# Altium schematic sheet Module-POWER.SchDoc
size A3; SheetNumber: 1; SheetTotal: 1
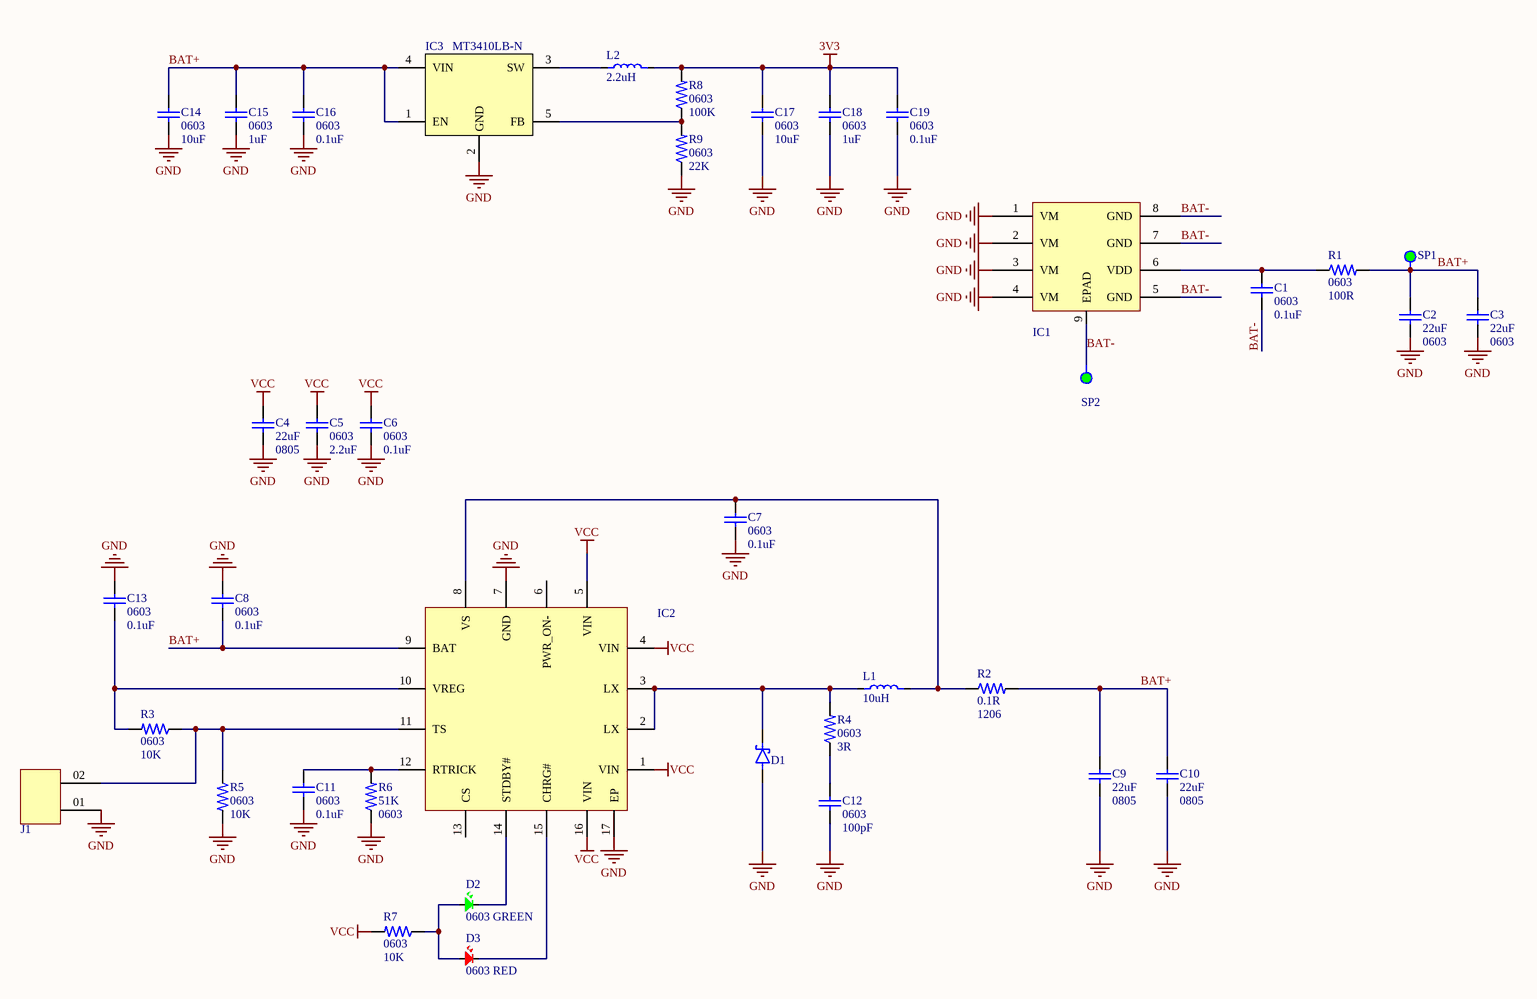
[diagram p0: Module-POWER.SchDoc]

## Parts
C1  value 0.1uF  Package: 0603  [SMD-CAP-0603-YAGEO]  (hidden comment: 0.1 µF ±10% 16V Ceramic Capacitor X7R 0603 (1608 Metric))
C2  value 22uF  Package: 0603  [SMD-CAP-0603-YAGEO]  (hidden comment: 22 µF ±20% 10V Ceramic Capacitor X5R 0603 (1608 Metric))
C3  value 22uF  Package: 0603  [SMD-CAP-0603-YAGEO]  (hidden comment: 22 µF ±20% 10V Ceramic Capacitor X5R 0603 (1608 Metric))
C4  value 22uF  Package: 0805  [SMD-CAP-0805-YAGEO]  (hidden comment: 22 µF ±20% 25V Ceramic Capacitor X5R 0805 (2012 Metric))
C5  value 2.2uF  Package: 0603  [SMD-CAP-0603-YAGEO]  (hidden comment: 2.2 µF ±10% 25V Ceramic Capacitor X5R 0603 (1608 Metric))
C6  value 0.1uF  Package: 0603  [SMD-CAP-0603-YAGEO]  (hidden comment: 0.1 µF ±10% 100V Ceramic Capacitor X7R 0603 (1608 Metric))
C7  value 0.1uF  Package: 0603  [SMD-CAP-0603-YAGEO]  (hidden comment: 0.1 µF ±10% 100V Ceramic Capacitor X7R 0603 (1608 Metric))
C8  value 0.1uF  Package: 0603  [SMD-CAP-0603-YAGEO]  (hidden comment: 0.1 µF ±10% 100V Ceramic Capacitor X7R 0603 (1608 Metric))
C9  value 22uF  Package: 0805  [SMD-CAP-0805-YAGEO]  (hidden comment: 22 µF ±20% 25V Ceramic Capacitor X5R 0805 (2012 Metric))
C10  value 22uF  Package: 0805  [SMD-CAP-0805-YAGEO]  (hidden comment: 22 µF ±20% 25V Ceramic Capacitor X5R 0805 (2012 Metric))
C11  value 0.1uF  Package: 0603  [SMD-CAP-0603-YAGEO]  (hidden comment: 0.1 µF ±10% 100V Ceramic Capacitor X7R 0603 (1608 Metric))
C12  value 100pF  Package: 0603  [SMD-CAP-0603-YAGEO]  (hidden comment: 100 pF ±5% 50V Ceramic Capacitor C0G, NP0 0603 (1608 Metric))
C13  value 0.1uF  Package: 0603  [SMD-CAP-0603-YAGEO]  (hidden comment: 0.1 µF ±10% 100V Ceramic Capacitor X7R 0603 (1608 Metric))
C14  value 10uF  Package: 0603  [SMD-CAP-0603-YAGEO]  (hidden comment: 10 µF ±20% 25V Ceramic Capacitor X5R 0603 (1608 Metric))
C15  value 1uF  Package: 0603  [SMD-CAP-0603-YAGEO]  (hidden comment: 1 µF -20%, +80% 10V Ceramic Capacitor Y5V (F) 0603 (1608 Metric))
C16  value 0.1uF  Package: 0603  [SMD-CAP-0603-YAGEO]  (hidden comment: 0.1 µF ±10% 16V Ceramic Capacitor X7R 0603 (1608 Metric))
C17  value 10uF  Package: 0603  [SMD-CAP-0603-YAGEO]  (hidden comment: 10 µF ±20% 25V Ceramic Capacitor X5R 0603 (1608 Metric))
C18  value 1uF  Package: 0603  [SMD-CAP-0603-YAGEO]  (hidden comment: 1 µF -20%, +80% 10V Ceramic Capacitor Y5V (F) 0603 (1608 Metric))
C19  value 0.1uF  Package: 0603  [SMD-CAP-0603-YAGEO]  (hidden comment: 0.1 µF ±10% 16V Ceramic Capacitor X7R 0603 (1608 Metric))
D1  Diode 40 V 3A Surface Mount DO-214AC (SMA)  [SMD-DO-214AC-214-CT]  (value not drawn)
D2  0603 GREEN  [LED0603_GREEN]
D3  0603 RED  [LED0603_RED]
IC1  XB8089D  [SOIC-8-XB8089D]  (value not drawn)
IC2  5V~12V Lithium-ion/Polymer 1~2 2A TQFN-16-EP(4x4) Battery Management ROHS  [TQFN-16 - TP5100]  (value not drawn)
IC3  MT3410LB-N  [SOT23-5-MT3410]
J1  Connector Header Through Hole 2 position  [HEADER-2.54-2]  (value not drawn)
L1  value 10uH  [SMD-HxLxW-4.5x6.5x6.0-PEC]  (hidden comment: 10 µH Shielded Drum Core, Wirewound Inductor 3.7 A 74.8mOhm Max 2-SMD, J-Lead)
L2  value 2.2uH  [SMD-HxLxW-3.0x5.5x5.0-PEC]  (hidden comment: 2.2 µH Shielded Drum Core, Wirewound Inductor 6.3 A 22mOhm Max 2-SMD, J-Lead)
R1  value 100R  Package: 0603  [SMD-RES-0603-RS]  (hidden comment: 100 Ohms ±1% 0.1W, 1/10W Chip Resistor 0603 (1608 Metric) Automotive AEC-Q200, High Voltage Thick Film)
R2  value 0.1R  Package: 1206  [SMD-RES-1206-YAGEO]  (hidden comment: 100 mOhms ±5% 0.25W, 1/4W Chip Resistor 1206 (3216 Metric) Current Sense Thick Film)
R3  value 10K  Package: 0603  [SMD-RES-0603-YAGEO]  (hidden comment: 10 kOhms ±1% 0.1W, 1/10W Chip Resistor 0603 (1608 Metric) Moisture Resistant Thick Film)
R4  value 3R  Package: 0603  [SMD-RES-0603-YAGEO]  (hidden comment: 3 Ohms ±1% 0.1W, 1/10W Chip Resistor 0603 (1608 Metric) Thin Film)
R5  value 10K  Package: 0603  [SMD-RES-0603-YAGEO]  (hidden comment: 10 kOhms ±1% 0.1W, 1/10W Chip Resistor 0603 (1608 Metric) Moisture Resistant Thick Film)
R6  value 51K  Package: 0603  [SMD-RES-0603-YAGEO]  (hidden comment: 51 kOhms ±1% 0.1W, 1/10W Chip Resistor 0603 (1608 Metric) Moisture Resistant Thick Film)
R7  value 10K  Package: 0603  [SMD-RES-0603-YAGEO]  (hidden comment: 10 kOhms ±1% 0.1W, 1/10W Chip Resistor 0603 (1608 Metric) Moisture Resistant Thick Film)
R8  value 100K  Package: 0603  [SMD-RES-0603-YAGEO]  (hidden comment: 100 kOhms ±1% 0.1W, 1/10W Chip Resistor 0603 (1608 Metric) Moisture Resistant Thick Film)
R9  value 22K  Package: 0603  [SMD-RES-0603-YAGEO]  (hidden comment: 22 kOhms ±1% 0.1W, 1/10W Chip Resistor 0603 (1608 Metric) Moisture Resistant Thick Film)
SP1  SP  [SOLDERING PAD BIG 3]  (value not drawn)  (no BOM)
SP2  SP  [SOLDERING PAD BIG 3]  (value not drawn)  (no BOM)

## Nets
3V3: C17.2 C18.2 C19.2 L2.2 R8.2
GND: C2.2 C3.1 C4.1 C5.1 C6.1 C7.1 C8.1 C9.1 C10.1 C11.1 C12.1 C13.1 C14.1 C15.1 C16.1 C17.1 C18.1 C19.1 D1.2(A) IC1.1(VM) IC1.2(VM) IC1.3(VM) IC1.4(VM) IC2.7(GND) IC2.17(EP) IC3.2(GND) J1.01 R5.2 R6.1 R9.1
VCC: C4.2 C5.2 C6.2 IC2.1(VIN) IC2.4(VIN) IC2.5(VIN) IC2.16(VIN) R7.2
BAT+: C2.1 C3.2 C8.2 C9.2 C10.2 C14.2 C15.2 C16.2 IC2.9(BAT) IC3.1(EN) IC3.4(VIN) R1.2 R2.2 SP1.1
BAT-: C1.1 IC1.5(GND) IC1.7(GND) IC1.8(GND) IC1.9(EPAD) SP2.1
NetC1_2: C1.2 IC1.6(VDD) R1.1
NetC7_2: C7.2 IC2.8(VS) L1.2 R2.1
NetC11_2: C11.2 IC2.12(RTRICK) R6.2
NetC12_2: C12.2 R4.1
NetC13_2: C13.2 IC2.10(VREG) R3.2
NetD1_1: D1.1(K) IC2.2(LX) IC2.3(LX) L1.1 R4.2
NetD2_1: D2.1 D3.1 R7.1
NetD2_2: D2.2 IC2.14(STDBY#)
NetD3_2: D3.2 IC2.15(CHRG#)
NetIC2_11: IC2.11(TS) J1.02 R3.1 R5.1
NetIC3_3: IC3.3(SW) L2.1
NetIC3_5: IC3.5(FB) R8.1 R9.2

Not connected (* = marked no-connect by the designer): IC2 6(PWR_ON-) 13(CS)

## Library data of the parts
C1 C16 C19 = CAP; 0.1uF; 16V; 0603; SMD; CC0603KRX7R7BB104: 0603 0.1 uF 16 V ±10 % Tolerance X7R SMT Multilayer Ceramic Capacitor; Manufacturer: Yageo; Insulation Resistance: 100GR; Designer: TVBac; Supplier: Digikey; Supplier Part Number: 311-1088-1-ND; Manufacturer Part Number: CC0603KRX7R7BB104; RoHS: Yes; Category: Ceramic Capacitors; Stock: 8705780; Pricing: 1=0.1, 10=0.042, 50=0.0238, 100=0.0185, 500=0.01392, 1000=0.01094, 4000=0.00915, 8000=0.00836, 12000=0.00796, 28000=0.00756, 100000=0.00547, 200000=0.00529, 400000=0.00497 (USD); Mounting Technology: Surface Mount; Case/Package: 0603; Pins: 2; Case Code (Metric): 1608; Case Code (Imperial): 0603; Material: Ceramic; Min Operating Temperature: -55°C; Max Operating Temperature: 125°C; Voltage Rating: 16V; Tolerance: 10%; Voltage Rating (DC): 16V; Package Quantity: 1; Packaging: Tape and Reel; Dielectric: X7R; Termination: SMD/SMT; Voltage: 16V; Series: CC; Length: 1.6mm; Width: 0.031inch; Height: 0.8mm; Thickness: 0.035inch; Depth: 0.8mm; Radiation Hardening: No; Reach SVHC Compliant: No; Lead Free: Lead Free; Halogen Free: Halogen Free; RoHS Compliant: Yes; ComponentLink1URL: https://datasheet.ciiva.com/11786/0900766b80d84f1d-11786077.pdf?src-supplier=Rs; ComponentLink1Description: https://datasheet.ciiva.com/11786/0900766b80d84f1d-11786077.pdf?src-supplier=Rs; ComponentLink2URL: https://datasheet.ciiva.com/8033/70765-8033799.pdf?src-supplier=Element14; ComponentLink2Description: https://datasheet.ciiva.com/8033/70765-8033799.pdf?src-supplier=Element14; ComponentLink3URL: https://datasheet.ciiva.com/7978/1489800-7978141.pdf?src-supplier=Element14; ComponentLink3Description: https://datasheet.ciiva.com/7978/1489800-7978141.pdf?src-supplier=Element14; ComponentLink4URL: https://datasheet.ciiva.com/28450/1489800-28450552.pdf?src-supplier=Element14; ComponentLink4Description: https://datasheet.ciiva.com/28450/1489800-28450552.pdf?src-supplier=Element14; ComponentLink5URL: https://datasheet.ciiva.com/46430/1734573-46430156.pdf?src-supplier=Element14; ComponentLink5Description: https://datasheet.ciiva.com/46430/1734573-46430156.pdf?src-supplier=Element14; ComponentLink6URL: https://datasheet.ciiva.com/144/mlccorderingcode-144183.pdf?src-supplier=Digikey; ComponentLink6Description: https://datasheet.ciiva.com/144/mlccorderingcode-144183.pdf?src-supplier=Digikey; ComponentLink7URL: https://datasheet.ciiva.com/144/mlccorderingcode-144182.pdf?src-supplier=Digikey; ComponentLink7Description: https://datasheet.ciiva.com/144/mlccorderingcode-144182.pdf?src-supplier=Digikey; ComponentLink8URL: https://datasheet.ciiva.com/144/mlccorderingcode-144184.pdf?src-supplier=Digikey; ComponentLink8Description: https://datasheet.ciiva.com/144/mlccorderingcode-144184.pdf?src-supplier=Digikey; ComponentLink9URL: https://datasheet.ciiva.com/8033/1734573-8033797.pdf?src-supplier=Element14; ComponentLink9Description: https://datasheet.ciiva.com/8033/1734573-8033797.pdf?src-supplier=Element14; ComponentLink10URL: https://datasheet.ciiva.com/13395/upy-gphc-x7r-6-3v-to-50v-8-13395674.pdf?src-supplier=Mouser; ComponentLink10Description: https://datasheet.ciiva.com/13395/upy-gphc-x7r-6-3v-to-50v-8-13395674.pdf?src-supplier=Mouser; ComponentLink11URL: https://datasheet.ciiva.com/11464/upy-gphc-x7r-6-3v-to-50v-8-11464735.pdf?src-supplier=Avnet; ComponentLink11Description: https://datasheet.ciiva.com/11464/upy-gphc-x7r-6-3v-to-50v-8-11464735.pdf?src-supplier=Avnet; ComponentLink12URL: https://datasheet.ciiva.com/15165/getdatasheetpartid-63554-15165387.pdf?src-supplier=Verical; ComponentLink12Description: https://datasheet.ciiva.com/15165/getdatasheetpartid-63554-15165387.pdf?src-supplier=Verical; ComponentLink13Description: Link Digikey; ComponentLink13URL: https://www.digikey.com/en/products/detail/yageo/CC0603KRX7R7BB104/302822
C2 C3 = CAP; 22uF; 25V; SMD; CC0603MRX5R6BB226: Multilayer Ceramic Capacitor, 22 uF, 10 V, ï¿½ 20%, X5R, 0603 [1608 Metric]; Manufacturer: Yageo; Designer: TVBac; Supplier: Future Electronics; Supplier Part Number: 9078094; Manufacturer Part Number: CC0603MRX5R6BB226; RoHS: No; Category: Ceramic Capacitors; Stock: 780000; Pricing: 4000=0.122, 8000=0.12, 12000=0.119, 16000=0.118 (USD); Lead Free: 5697LeadFree; Halogen Free: 5694HalogenFree; ComponentLink1URL: http://www.mouser.com/ds/2/447/Yageo_UPY-GP_NP0_16V-to-50V_9-358835.pdf?src-supplier=Mouser; ComponentLink1Description: http://www.mouser.com/ds/2/447/Yageo_UPY-GP_NP0_16V-to-50V_9-358835.pdf?src-supplier=Mouser; ComponentLink2URL: http://www.yageo.com/documents/recent/UPY-GPHC_X5R_4V-to-50V_25.pdf?src-supplier=Digikey; ComponentLink2Description: http://www.yageo.com/documents/recent/UPY-GPHC_X5R_4V-to-50V_25.pdf?src-supplier=Digikey; ComponentLink3URL: https://datasheet.octopart.com/CC0603MRX5R6BB226-Yageo-datasheet-137875056.pdf?src-supplier=Future+Electronics; ComponentLink3Description: https://datasheet.octopart.com/CC0603MRX5R6BB226-Yageo-datasheet-137875056.pdf?src-supplier=Future+Electronics; ComponentLink4URL: https://www.digikey.com/en/products/detail/yageo/CC0603MRX5R6BB226/5195226; ComponentLink4Description: Link Digikey; RoHS Compliant: 5897YesNo
C4 C9 C10 = CAP; 22uF; 0805; 25V; SMD; CC0805MKX5R8BB226: Ceramic Capacitor, Multilayer, Ceramic, 25V, 20% +Tol, 20% -Tol, X5R, 15% TC, 22uF, Surface Mount, 0805; Manufacturer: Yageo; Material: 4241ConductorMaterial; Supplier: Future Electronics; Supplier Part Number: 5072123; Manufacturer Part Number: CC0805MKX5R8BB226; RoHS: Yes; Category: Ceramic Capacitors; Stock: 90000; Pricing: 3000=0.112, 6000=0.11, 9000=0.0776, 12000=0.077, 15000=0.0753 (USD); Lead Free: 5697LeadFree; Halogen Free: 5694HalogenFree; ComponentLink1URL: http://www.mouser.com/ds/2/447/Yageo_UPY-GP_NP0_16V-to-50V_9-358835.pdf?src-supplier=Mouser; ComponentLink1Description: http://www.mouser.com/ds/2/447/Yageo_UPY-GP_NP0_16V-to-50V_9-358835.pdf?src-supplier=Mouser; ComponentLink2URL: http://www.yageo.com/documents/recent/UPY-GPHC_X5R_4V-to-50V_25.pdf?src-supplier=Digikey; ComponentLink2Description: http://www.yageo.com/documents/recent/UPY-GPHC_X5R_4V-to-50V_25.pdf?src-supplier=Digikey; ComponentLink3URL: https://datasheet.octopart.com/CC0805MKX5R8BB226-Yageo-datasheet-137700085.pdf?src-supplier=Future+Electronics; ComponentLink3Description: https://datasheet.octopart.com/CC0805MKX5R8BB226-Yageo-datasheet-137700085.pdf?src-supplier=Future+Electronics; ComponentLink4URL: https://datasheet.octopart.com/CC0805MKX5R8BB226-Yageo-datasheet-181969996.pdf?src-supplier=Farnell; ComponentLink4Description: https://datasheet.octopart.com/CC0805MKX5R8BB226-Yageo-datasheet-181969996.pdf?src-supplier=Farnell; ComponentLink5URL: https://datasheet.octopart.com/CC0805MKX5R8BB226-Yageo-datasheet-181969996.pdf?src-supplier=Element14; ComponentLink5Description: https://datasheet.octopart.com/CC0805MKX5R8BB226-Yageo-datasheet-181969996.pdf?src-supplier=Element14
C5 = CAP; 2.2uF; 25V; SMD; 0603; CC0603KRX5R8BB225: 0603 2.2 uF 25 V ±10% Tolerance X5R SMT Multilayer Ceramic Capacitor; Manufacturer: Yageo; Material: 4241ConductorMaterial; Designer: TVBac; Supplier: Future Electronics; Supplier Part Number: 2077058; Manufacturer Part Number: CC0603KRX5R8BB225; RoHS: Yes; Category: Ceramic Capacitors; Stock: 108000; Pricing: 4000=0.0441, 8000=0.0434, 12000=0.0429, 16000=0.0426, 20000=0.0417 (USD); Height: 900um; Halogen Free: 5694HalogenFree; Lead Free: 5697LeadFree; ComponentLink1URL: https://datasheet.ciiva.com/26936/getdatasheetpartid-782757-26936061.pdf?src-supplier=Verical; ComponentLink1Description: https://datasheet.ciiva.com/26936/getdatasheetpartid-782757-26936061.pdf?src-supplier=Verical
C6-C8 C11 C13 = CAP; 0.1uF; 100V; 0603; SMD; CC0603KRX7R0BB104: Multilayer Ceramic Capacitors MLCC - SMD/SMT 100V 0.1uF X7R 0603 10%; Manufacturer: Yageo; Material: 4241ConductorMaterial; Designer: TVBac; Supplier: Digikey; Supplier Part Number: 311-1523-1-ND; Manufacturer Part Number: CC0603KRX7R0BB104; RoHS: Yes; Category: Ceramic Capacitors; Stock: 5373598; Pricing: 1=0.17, 10=0.113, 50=0.0676, 100=0.0531, 500=0.03922, 1000=0.03246, 4000=0.02764, 8000=0.02572, 12000=0.02443, 28000=0.02314, 100000=0.01752, 200000=0.0171, 400000=0.01607 (USD); Mounting Technology: Surface Mount; Case/Package: 0603; Case Code (Metric): 1608; Case Code (Imperial): 0603; Weight: 7.1E-05oz; Min Operating Temperature: -55°C; Max Operating Temperature: 125°C; Package Quantity: 4000; Voltage Rating: 100V; Tolerance: 10%; Packaging: Tape and Reel; Dielectric: X7R; Termination: SMD/SMT; Voltage Rating (DC): 100V; Series: CC; Length: 0.063inch; Width: 0.031inch; Height: 900um; Thickness: 0.035inch; RoHS Compliant: Yes; Lead Free: 5697LeadFree; ComponentLink1URL: https://datasheet.ciiva.com/6277/mlccorderingcode-6277082.pdf?src-supplier=Digikey; ComponentLink1Description: https://datasheet.ciiva.com/6277/mlccorderingcode-6277082.pdf?src-supplier=Digikey; ComponentLink2URL: https://datasheet.ciiva.com/6277/mlccorderingcode-6277081.pdf?src-supplier=Digikey; ComponentLink2Description: https://datasheet.ciiva.com/6277/mlccorderingcode-6277081.pdf?src-supplier=Digikey; ComponentLink3URL: https://datasheet.ciiva.com/6277/mlccorderingcode-6277030.pdf?src-supplier=Digikey; ComponentLink3Description: https://datasheet.ciiva.com/6277/mlccorderingcode-6277030.pdf?src-supplier=Digikey; ComponentLink4Description: Link Digikey; ComponentLink4URL: https://www.digikey.com/en/products/detail/yageo/CC0603KRX7R0BB104/3476111?s=N4IgTCBcDaIMwEYEFoEFYx1cgcgERAF0BfIA
C12 = CAP; 100pF; 0603; SMD; CC0603JRNPO9BN101: 0603 100 pF 50 V ±5 % Tolerance NP0 SMT Multilayer Ceramic Capacitor; Manufacturer: Yageo; Temperature Coefficient: 30ppm/°C; Insulation Resistance: 100GR; Supplier: Future Electronics; Supplier Part Number: 4143889; Manufacturer Part Number: CC0603JRNPO9BN101; RoHS: Yes; Category: Ceramic Capacitors; Stock: 1960000; Pricing: 4000=0.0039, 12000=0.0038, 20000=0.0037, 80000=0.0036, 120000=0.0035 (USD); Mounting Technology: Surface Mount; Case/Package: 0603; Pins: 2; Case Code (Imperial): 0603; Case Code (Metric): 1608; Min Operating Temperature: -55°C; Max Operating Temperature: 125°C; Voltage Rating: 50V; Voltage Rating (DC): 50V; Tolerance: 5%; Dielectric: C0G; Termination: SMD/SMT; Voltage: 50V; Voltage Rating (AC): 50V; Packaging: Tape and Reel; Package Quantity: 4000; Series: CC; Length: 1.6mm; Width: 0.8mm; Height: 0.8mm; Depth: 0.8mm; Radiation Hardening: No; Lead Free: Lead Free; Halogen Free: 5694HalogenFree; RoHS Compliant: Yes; Reach SVHC Compliant: Unknown; ComponentLink1URL: https://datasheet.ciiva.com/11786/0900766b8079c870-11786060.pdf?src-supplier=Rs; ComponentLink1Description: https://datasheet.ciiva.com/11786/0900766b8079c870-11786060.pdf?src-supplier=Rs; ComponentLink2URL: https://datasheet.ciiva.com/7978/1443161-7978127.pdf?src-supplier=Element14; ComponentLink2Description: https://datasheet.ciiva.com/7978/1443161-7978127.pdf?src-supplier=Element14; ComponentLink3URL: https://datasheet.ciiva.com/28450/1443161-28450457.pdf?src-supplier=Element14; ComponentLink3Description: https://datasheet.ciiva.com/28450/1443161-28450457.pdf?src-supplier=Element14; ComponentLink4URL: https://datasheet.ciiva.com/46430/1835847-46430151.pdf?src-supplier=Element14; ComponentLink4Description: https://datasheet.ciiva.com/46430/1835847-46430151.pdf?src-supplier=Element14; ComponentLink5URL: https://datasheet.ciiva.com/144/mlccorderingcode-144629.pdf?src-supplier=Digikey; ComponentLink5Description: https://datasheet.ciiva.com/144/mlccorderingcode-144629.pdf?src-supplier=Digikey; ComponentLink6URL: https://datasheet.ciiva.com/144/mlccorderingcode-144628.pdf?src-supplier=Digikey; ComponentLink6Description: https://datasheet.ciiva.com/144/mlccorderingcode-144628.pdf?src-supplier=Digikey; ComponentLink7URL: https://datasheet.ciiva.com/144/mlccorderingcode-144630.pdf?src-supplier=Digikey; ComponentLink7Description: https://datasheet.ciiva.com/144/mlccorderingcode-144630.pdf?src-supplier=Digikey; ComponentLink8URL: https://datasheet.ciiva.com/11464/upy-gp-np0-16v-to-50v-8-11464725.pdf?src-supplier=Avnet; ComponentLink8Description: https://datasheet.ciiva.com/11464/upy-gp-np0-16v-to-50v-8-11464725.pdf?src-supplier=Avnet; ComponentLink9URL: https://datasheet.ciiva.com/26829/getdatasheetpartid-403525-26829372.pdf?src-supplier=Verical; ComponentLink9Description: https://datasheet.ciiva.com/26829/getdatasheetpartid-403525-26829372.pdf?src-supplier=Verical
C14 C17 = CAP; 10uF; 25V; SMD; 0603; CC0603MRX5R8BB106: Multilayer Ceramic Capacitor, 10 uF, 25 V, ï¿½ 20%, X5R, 0603 [1608 Metric]; Manufacturer: Yageo; Designer: TVBac; Supplier: Future Electronics; Supplier Part Number: 3086968; Manufacturer Part Number: CC0603MRX5R8BB106; RoHS: Yes; Category: Ceramic Capacitors; Stock: 296000; Pricing: 4000=0.155, 8000=0.153, 12000=0.151 (USD); Mounting Technology: Surface Mount; Case/Package: 0603; Case Code (Imperial): 0603; Case Code (Metric): 1608; Min Operating Temperature: -55°C; Max Operating Temperature: 85°C; Packaging: Cut Tape; Tolerance: 20%; Voltage Rating: 25V; Series: CC; Dielectric: X5R; Voltage Rating (DC): 25V; RoHS Compliant: Yes; Halogen Free: Halogen Free; Lead Free: Lead Free; ComponentLink1URL: https://www.yageo.com/upload/media/product/productsearch/datasheet/mlcc/UPY-GPHC_X5R_4V-to-50V_26.pdf?src-supplier=Digikey; ComponentLink1Description: https://www.yageo.com/upload/media/product/productsearch/datasheet/mlcc/UPY-GPHC_X5R_4V-to-50V_26.pdf?src-supplier=Digikey; ComponentLink2URL: https://datasheet.octopart.com/CC0603MRX5R8BB106-Yageo-datasheet-182965619.pdf?src-supplier=Farnell; ComponentLink2Description: https://datasheet.octopart.com/CC0603MRX5R8BB106-Yageo-datasheet-182965619.pdf?src-supplier=Farnell; ComponentLink3Description: Link Digikey; ComponentLink3URL: https://www.digikey.com/en/products/detail/yageo/CC0603MRX5R8BB106/7164378
C15 C18 = CAP; 1uF; 10V; 0603; SMD; CC0603ZRY5V6BB105: Surface Mount Ceramic Multilayer Capacitor 1uF -20% to 80% Y5V 10V 0603 Paper T/R; Manufacturer: Yageo; Dielectric Material: 4241ConductorMaterial; Designer: TVBac; Supplier: Digikey; Supplier Part Number: 311-1357-1-ND; Manufacturer Part Number: CC0603ZRY5V6BB105; RoHS: Yes; Category: Ceramic Capacitors; Stock: 2070294; Pricing: 1=0.1, 10=0.041, 50=0.0234, 100=0.0182, 500=0.01366, 1000=0.01074 (USD); Voltage Rating (AC): 10V; Lead Free: 5697LeadFree; Halogen Free: 5694HalogenFree; ComponentLink1URL: https://datasheet.ciiva.com/23768/97931-23768032.pdf?src-supplier=Newark; ComponentLink1Description: https://datasheet.ciiva.com/23768/97931-23768032.pdf?src-supplier=Newark; ComponentLink2URL: https://datasheet.ciiva.com/144/mlccorderingcode-144397.pdf?src-supplier=Digikey; ComponentLink2Description: https://datasheet.ciiva.com/144/mlccorderingcode-144397.pdf?src-supplier=Digikey; ComponentLink3URL: https://datasheet.ciiva.com/144/mlccorderingcode-144398.pdf?src-supplier=Digikey; ComponentLink3Description: https://datasheet.ciiva.com/144/mlccorderingcode-144398.pdf?src-supplier=Digikey; ComponentLink4URL: https://datasheet.ciiva.com/144/mlccorderingcode-144399.pdf?src-supplier=Digikey; ComponentLink4Description: https://datasheet.ciiva.com/144/mlccorderingcode-144399.pdf?src-supplier=Digikey; ComponentLink5URL: https://datasheet.ciiva.com/5425/upy-gphc-y5v-6-3v-to-50v-5-5425434.pdf?src-supplier=Mouser; ComponentLink5Description: https://datasheet.ciiva.com/5425/upy-gphc-y5v-6-3v-to-50v-5-5425434.pdf?src-supplier=Mouser; ComponentLink6URL: https://datasheet.ciiva.com/7978/1132289-7978185.pdf?src-supplier=Element14; ComponentLink6Description: https://datasheet.ciiva.com/7978/1132289-7978185.pdf?src-supplier=Element14; ComponentLink7URL: https://datasheet.ciiva.com/8033/1132289-8033926.pdf?src-supplier=Element14; ComponentLink7Description: https://datasheet.ciiva.com/8033/1132289-8033926.pdf?src-supplier=Element14; ComponentLink8URL: https://datasheet.ciiva.com/8033/1132289-8033928.pdf?src-supplier=Element14; ComponentLink8Description: https://datasheet.ciiva.com/8033/1132289-8033928.pdf?src-supplier=Element14; ComponentLink9Description: Link Digikey; ComponentLink9URL: https://www.digikey.com/en/products/detail/yageo/CC0603ZRY5V6BB105/2103095
D1 = DIODE; SMD; SCHOTTKY; SS34-HF: Diode Schottky Si 40V 3A 2-Pin SMA T/R; Manufacturer: Comchip; Designer: TVBac; Supplier: Digikey; Supplier Part Number: 641-2115-1-ND; Manufacturer Part Number: SS34-HF; RoHS: Yes; Category: LDO; Stock: 65957; Pricing: 1=0.46, 10=0.325, 100=0.164, 500=0.14536, 1000=0.11312, 2000=0.10124 (USD); RoHS Compliant: Yes; ComponentLink1URL: http://www.comchiptech.com/admin/files/product/20190514101641.pdf?src-supplier=Digikey; ComponentLink1Description: http://www.comchiptech.com/admin/files/product/20190514101641.pdf?src-supplier=Digikey; ComponentLink2Description: Link Digikey; ComponentLink2URL: https://www.digikey.com/en/products/detail/comchip-technology/SS34-HF/10279693
D2 = L0603_GREEN: 225mcd~450mcd Colorless Transparent Lens -40℃~+85℃ Positive Stick 520nm~535nm Green 120° 70mW 2.4V~3V 0603 LED Indication - Discrete ROHS; Manufacturer: Amicc; Manufacture Part Number: A-SP192DGHC-C01-4T; Packaging: Cut Tape (CT); Link: https://www.lcsc.com/product-detail/LED-Indication-Discrete_Amicc-A-SP192DGHC-C01-4T_C19171301.html?s_z=n_LED%200603%20green; Package: 0603
D3 = L0603_RED: 20mA 330mcd Colorless Transparent Lens -20℃~+85℃ Positive Stick 620nm~630nm Red 120° 50mW 2.3V 0603 LED Indication - Discrete ROHS; Manufacturer: XINGLIGHT; Manufacture Part Number: XL-1608SURC-06; Packaging: Cut Tape (CT); Link: https://www.lcsc.com/product-detail/LED-Indication-Discrete_XINGLIGHT-XL-1608SURC-06_C965799.html?s_z=n_LED%200603%20red; Package: 0603
IC2 = TP5100
IC3 = MT3410LB-N: SOT-23-5 DC-DC Converters ROHS; Manufacturer: XI'AN Aerosemi Tech; Manufacture Part Number: MT3410LB-N; Packaging: Cut Tape; Link: https://www.lcsc.com/product-detail/DC-DC-Converters_XI-AN-Aerosemi-Tech-MT3410LB-N_C42420805.html?s_z=n_mt3410l; Package: SOT-23-5; LCSC Part: C42420805
J1 = HEADER; 2PIN; 2.54; VER; TSW-101-15-T-D: Headers & Wire Housings Classic PCB Header Strips, 0.100 pitch; Manufacturer: Samtec; Designer: TVBac; Supplier: Arrow Electronics; Supplier Part Number: TSW-101-15-T-D; Manufacturer Part Number: TSW-101-15-T-D; RoHS: Yes; Category: Connectors; Stock: 4464; Pricing: 1=0.18, 50=0.14, 100=0.12, 500=0.1, 1000=0.07, 2000=0.06, 5000=0.05 (USD); ComponentLink1URL: https://datasheet.ciiva.com/10283/htsw-th-10283318.pdf?src-supplier=Avnet; ComponentLink1Description: https://datasheet.ciiva.com/10283/htsw-th-10283318.pdf?src-supplier=Avnet; ComponentLink2Description: Link Digikey; ComponentLink2URL: https://www.digikey.com/en/products/detail/samtec-inc/TSW-101-15-T-D/7861723
L1 = IND; 10uH; 3.7A; ETQ-P3M100HFN: Power Choke Shielded Wirewound 10uH 20% 100KHz Metal 3.7A 0.0748Ohm DCR Automotive T/R; Manufacturer: Panasonic; Core Material: Metal,Composite; Saturation Current: 5.5A; DC Resistance (DCR): 74.8mR; Supplier: Mouser; Supplier Part Number: 667-ETQ-P3M100HFN; Manufacturer Part Number: ETQ-P3M100HFN; RoHS: No; Category: Fixed Inductors; Stock: 1835; Pricing: 1=1.11, 10=0.973, 50=0.756, 100=0.705, 1000=0.627, 10000=0.58 (USD); Mounting Technology: Surface Mount; Case/Package: SMD/SMT; Min Operating Temperature: -40°C; Max Operating Temperature: 150°C; Series: PCC-M0630M; Packaging: Cut Tape; Tolerance: 20%; Shielding: Shielded; Test Frequency: 100kHz; Ratings: AEC-Q200; ComponentLink1URL: http://datasheet.octopart.com/ETQ-P3M100HFN-Panasonic-datasheet-136768817.pdf?src-supplier=Rs; ComponentLink1Description: http://datasheet.octopart.com/ETQ-P3M100HFN-Panasonic-datasheet-136768817.pdf?src-supplier=Rs; ComponentLink2URL: https://datasheet.octopart.com/ETQP3M100HFN-Panasonic-datasheet-179054672.pdf?src-supplier=Farnell; ComponentLink2Description: https://datasheet.octopart.com/ETQP3M100HFN-Panasonic-datasheet-179054672.pdf?src-supplier=Farnell; ComponentLink3URL: http://datasheet.octopart.com/ETQ-P3M100HFN-Panasonic-datasheet-136768817.pdf?src-supplier=Verical; ComponentLink3Description: http://datasheet.octopart.com/ETQ-P3M100HFN-Panasonic-datasheet-136768817.pdf?src-supplier=Verical; ComponentLink4URL: http://datasheet.octopart.com/ETQ-P3M100HFN-Panasonic-datasheet-136768817.pdf?src-supplier=Onlinecomponents.com; ComponentLink4Description: http://datasheet.octopart.com/ETQ-P3M100HFN-Panasonic-datasheet-136768817.pdf?src-supplier=Onlinecomponents.com; ComponentLink5URL: http://datasheet.octopart.com/ETQ-P3M100HFN-Panasonic-datasheet-136768817.pdf?src-supplier=Arrow+Electronics; ComponentLink5Description: http://datasheet.octopart.com/ETQ-P3M100HFN-Panasonic-datasheet-136768817.pdf?src-supplier=Arrow+Electronics; ComponentLink6URL: http://datasheet.octopart.com/ETQ-P3M100HFN-Panasonic-datasheet-136768817.pdf?src-supplier=Avnet; ComponentLink6Description: http://datasheet.octopart.com/ETQ-P3M100HFN-Panasonic-datasheet-136768817.pdf?src-supplier=Avnet; ComponentLink7URL: http://datasheet.octopart.com/ETQ-P3M100HFN-Panasonic-datasheet-136768817.pdf?src-supplier=Future+Electronics; ComponentLink7Description: http://datasheet.octopart.com/ETQ-P3M100HFN-Panasonic-datasheet-136768817.pdf?src-supplier=Future+Electronics; ComponentLink8URL: https://datasheet.octopart.com/ETQP3M100HFN-Panasonic-datasheet-97125959.pdf?src-supplier=Element14; ComponentLink8Description: https://datasheet.octopart.com/ETQP3M100HFN-Panasonic-datasheet-97125959.pdf?src-supplier=Element14; ComponentLink9URL: http://datasheet.octopart.com/ETQ-P3M100HFN-Panasonic-datasheet-136768817.pdf?src-supplier=Digikey; ComponentLink9Description: http://datasheet.octopart.com/ETQ-P3M100HFN-Panasonic-datasheet-136768817.pdf?src-supplier=Digikey; ComponentLink10URL: http://datasheet.octopart.com/ETQ-P3M100HFN-Panasonic-datasheet-136768817.pdf?src-supplier=Newark; ComponentLink10Description: http://datasheet.octopart.com/ETQ-P3M100HFN-Panasonic-datasheet-136768817.pdf?src-supplier=Newark; ComponentLink11URL: http://datasheet.octopart.com/ETQ-P3M100HFN-Panasonic-datasheet-136768817.pdf?src-supplier=Mouser; ComponentLink11Description: http://datasheet.octopart.com/ETQ-P3M100HFN-Panasonic-datasheet-136768817.pdf?src-supplier=Mouser; ComponentLink12URL: https://datasheet.octopart.com/ETQ-P3M100HFN-Panasonic-datasheet-136768817.pdf?src-supplier=Newark; ComponentLink12Description: https://datasheet.octopart.com/ETQ-P3M100HFN-Panasonic-datasheet-136768817.pdf?src-supplier=Newark; ComponentLink13URL: http://datasheet.octopart.com/ETQ-P3M100HFN-Panasonic-datasheet-136768817.pdf?src-supplier=TTI; ComponentLink13Description: http://datasheet.octopart.com/ETQ-P3M100HFN-Panasonic-datasheet-136768817.pdf?src-supplier=TTI; ComponentLink14URL: http://datasheet.octopart.com/ETQ-P3M100HFN-Panasonic-datasheet-136768817.pdf?src-supplier=Electro+Sonic; ComponentLink14Description: http://datasheet.octopart.com/ETQ-P3M100HFN-Panasonic-datasheet-136768817.pdf?src-supplier=Electro+Sonic; ComponentLink15URL: http://datasheet.octopart.com/ETQ-P3M100HFN-Panasonic-datasheet-136768817.pdf?src-supplier=NAC+Semi; ComponentLink15Description: http://datasheet.octopart.com/ETQ-P3M100HFN-Panasonic-datasheet-136768817.pdf?src-supplier=NAC+Semi
L2 = IND; 2.2uH; SMD; 6.3A; ETQ-P3M2R2KVP: Ind Power Shielded Wirewound 2.2uH 20% 100KHz Metal 6.3A (5.5 X 5 X 3mm) Emboss T/R; Manufacturer: Panasonic; Core Material: Metal,Composite; RMS Current (Irms): 5.2A; Saturation Current: 10.1A; DC Resistance (DCR): 22mR; Designer: TVBac; Supplier: Digikey; Supplier Part Number: P19759CT-ND; Manufacturer Part Number: ETQ-P3M2R2KVP; RoHS: Yes; Category: Fixed Inductors; Stock: 6203; Pricing: 1=0.89, 10=0.752, 25=0.6836, 50=0.6426, 100=0.5333, 250=0.49224, 500=0.4649, 1000=0.42387 (USD); Mounting Technology: Surface Mount; Case/Package: SMD/SMT; Min Operating Temperature: -55°C; Max Operating Temperature: 155°C; Packaging: Cut Tape; Inductance Tolerance: 20%; Series: PCC-M0530M; Tolerance: 20%; Shielding: Shielded; Test Frequency: 100kHz; Ratings: AEC-Q200; RoHS Compliant: Yes; Reach SVHC Compliant: Unknown; ComponentLink1URL: http://www.farnell.com/datasheets/2820815.pdf?src-supplier=Farnell; ComponentLink1Description: http://www.farnell.com/datasheets/2820815.pdf?src-supplier=Farnell; ComponentLink2URL: https://industrial.panasonic.com/cdbs/www-data/pdf/AGL0000/AGL0000C63.pdf?src-supplier=Digikey; ComponentLink2Description: https://industrial.panasonic.com/cdbs/www-data/pdf/AGL0000/AGL0000C63.pdf?src-supplier=Digikey; ComponentLink3URL: http://www.farnell.com/datasheets/2820815.pdf?src-supplier=Newark; ComponentLink3Description: http://www.farnell.com/datasheets/2820815.pdf?src-supplier=Newark; ComponentLink4URL: https://datasheet.octopart.com/ETQP3M2R2KVP-Panasonic-datasheet-98950113.pdf?src-supplier=Newark; ComponentLink4Description: https://datasheet.octopart.com/ETQP3M2R2KVP-Panasonic-datasheet-98950113.pdf?src-supplier=Newark; ComponentLink5URL: http://www.farnell.com/datasheets/2144948.pdf?src-supplier=Element14; ComponentLink5Description: http://www.farnell.com/datasheets/2144948.pdf?src-supplier=Element14; ComponentLink6URL: https://datasheet.octopart.com/ETQP3M2R2KVP-Panasonic-datasheet-65850535.pdf?src-supplier=Future+Electronics; ComponentLink6Description: https://datasheet.octopart.com/ETQP3M2R2KVP-Panasonic-datasheet-65850535.pdf?src-supplier=Future+Electronics; ComponentLink7URL: https://datasheet.octopart.com/ETQP3M2R2KVP-Panasonic-datasheet-137675050.pdf?src-supplier=TME; ComponentLink7Description: https://datasheet.octopart.com/ETQP3M2R2KVP-Panasonic-datasheet-137675050.pdf?src-supplier=TME; ComponentLink8Description: Link Digikey; ComponentLink8URL: https://www.digikey.com/en/products/detail/panasonic-electronic-components/ETQ-P3M2R2KVP/6134777
R1 = RES; 100R; 0603; SMD; KTR03EZPF1000: Res Thick Film 0603 100 Ohm 1% 0.1W(1/10W) ±100ppm/C Pad SMD T/R Automotive AEC-Q200; Manufacturer: Rohm; Max Power Dissipation: 100mW; Temperature Coefficient: 100ppm/°C; Voltage Rating: 350V; Designer: TVBac; Supplier: Mouser; Supplier Part Number: 755-KTR03EZPF1000; Manufacturer Part Number: KTR03EZPF1000; RoHS: Yes; Category: Chip SMD Resistors; Stock: 66325; Pricing: 1=0.12, 10=0.039, 50=0.039, 100=0.024, 1000=0.021, 10000=0.015 (USD); Case/Package: 0603; Case Code (Metric): 1608; Case Code (Imperial): 0603; Min Operating Temperature: -55°C; Max Operating Temperature: 155°C; Packaging: Cut Tape; Tolerance: 1%; Number of Terminations: 2; Features: Automotive AEC-Q200; Series: KTR; Voltage Rating (DC): 350V; Ratings: AEC-Q200; RoHS Compliant: Yes; ComponentLink1URL: https://datasheet.ciiva.com/14926/ktr-14926472.pdf?src-supplier=Digikey; ComponentLink1Description: https://datasheet.ciiva.com/14926/ktr-14926472.pdf?src-supplier=Digikey; ComponentLink2URL: https://datasheet.ciiva.com/14932/ktr-14932133.pdf?src-supplier=Digikey; ComponentLink2Description: https://datasheet.ciiva.com/14932/ktr-14932133.pdf?src-supplier=Digikey; ComponentLink3Description: Link Digikey; ComponentLink3URL: https://www.digikey.com/en/products/detail/rohm-semiconductor/KTR03EZPF1000/4051558
R2 = RES; 0.1R; 1206; SMD; RL1206JR-070R1L: SMD Chip Resistor, 100 MOhm, ± 5%, 250 mW, 1206 [3216 Metric], Thick Film, Low Ohmic; Manufacturer: Yageo; Supplier: Future Electronics; Supplier Part Number: 1607514; Manufacturer Part Number: RL1206JR-070R1L; RoHS: Yes; Category: Chip SMD Resistors; Stock: 195000; Pricing: 5000=0.0122, 10000=0.012, 15000=0.0119, 25000=0.0117, 50000=0.0114 (USD); ComponentLink1URL: https://datasheet.ciiva.com/8083/pyu-rl-521-rohs-l-5-8083925.pdf?src-supplier=Avnet; ComponentLink1Description: https://datasheet.ciiva.com/8083/pyu-rl-521-rohs-l-5-8083925.pdf?src-supplier=Avnet; ComponentLink2URL: https://datasheet.ciiva.com/5558/pyu-rl-hp-521-rohs-l-2-5558220.pdf?src-supplier=Mouser; ComponentLink2Description: https://datasheet.ciiva.com/5558/pyu-rl-hp-521-rohs-l-2-5558220.pdf?src-supplier=Mouser
R3 R5 R7 = RES; 10K; 0603; SMD; RC0603FR-0710KL: SMD Chip Resistor, 10 Kohm, ½ 1%, 100 Mw, 0603 [1608 Metric], Thick Film, General Purpose; Manufacturer: Yageo; Temperature Coefficient: 100ppm/°C; Voltage Rating (DC): 50V; Voltage Rating: 75V; Power Rating: 100mW; Supplier: Future Electronics; Supplier Part Number: 4023214; Manufacturer Part Number: RC0603FR-0710KL; RoHS: Yes; Category: Chip SMD Resistors; Stock: 60200000; Pricing: 5000=0.0019, 20000=0.0018, 25000=0.0012, 50000=0.0018, 125000=0.0017, 200000=0.0016, 250000=0.0011, 750000=0.001 (USD); Case/Package: 0603; Pins: 2; Case Code (Imperial): 0603; Case Code (Metric): 1608; Weight: 7.1E-05oz; Min Operating Temperature: -55°C; Max Operating Temperature: 155°C; Tolerance: 1%; Packaging: Tape and Reel; Resistor Type: Thick Film; Termination: SMD/SMT; Features: Moisture Resistant; Series: RC; Max Power Dissipation: 100mW; Number of Terminations: 2; Resistance Tolerance: 1%; Construction: Rectangular; Length: 1.6mm; Width: 0.8mm; Height: 0.45mm; Depth: 0.8mm; Lead Pitch: 0.3mm; Reach SVHC Compliant: No; Lead Free: 5697LeadFree; Military Standard: Not; RoHS Compliant: Yes
R4 = RES; 3R; 0603; SMD; RT0603FRE073RL: Thin Film Res 0603 3 Ohm 1% 0.1W(1/10W) 50ppm/C Epoxy Pad SMD T/R; Manufacturer: Yageo; Max Power Dissipation: 100mW; Temperature Coefficient: 50ppm/°C; Supplier: Digikey; Supplier Part Number: 13-RT0603FRE073RLCT-ND; Manufacturer Part Number: RT0603FRE073RL; RoHS: Yes; Category: Chip SMD Resistors; Stock: 6986; Pricing: 1=0.1, 10=0.024, 50=0.022, 100=0.0194, 500=0.01888, 1000=0.01836 (USD); Case/Package: 0603; Min Operating Temperature: -55°C; Max Operating Temperature: 155°C; Packaging: Tape and Reel; Number of Terminations: 2; Tolerance: 1%; Features: Moisture Resistant; Series: RT; Length: 0.063inch; Width: 0.031inch; Height: 0.022inch; RoHS Compliant: Yes; ComponentLink1URL: http://www.yageo.com/documents/recent/PYu-RT_1-to-0.01_RoHS_L_8.pdf?src-supplier=Digikey; ComponentLink1Description: http://www.yageo.com/documents/recent/PYu-RT_1-to-0.01_RoHS_L_8.pdf?src-supplier=Digikey; ComponentLink2URL: https://datasheet.octopart.com/RT0603FRE073RL-Yageo-datasheet-176402239.pdf?src-supplier=Newark; ComponentLink2Description: https://datasheet.octopart.com/RT0603FRE073RL-Yageo-datasheet-176402239.pdf?src-supplier=Newark
R6 = RES; 51K; 0603; SMD; RC0603FR-07510KL: SMD Chip Resistor, 510 Kohm, ½ 1%, 100 Mw, 0603 [1608 Metric], Thick Film, General Purpose; Manufacturer: Yageo; Voltage Rating (DC): 50V; Supplier: Future Electronics; Supplier Part Number: 2880904; Manufacturer Part Number: RC0603FR-07510KL; RoHS: Yes; Category: Chip SMD Resistors; Stock: 435000; Pricing: 5000=0.0012, 25000=0.0011, 125000=0.0011, 250000=0.001, 750000=0.001 (USD); Lead Free: 5697LeadFree
R8 = RES; 100K; 0603; SMD; RC0603FR-07100KL: SMD Chip Resistor, 100 kOhm, ï¿½ 1%, 100 mW, 0603 [1608 Metric], Thick Film, General Purpose; Manufacturer: Yageo; Temperature Coefficient: 100ppm/°C; Voltage Rating (DC): 50V; Power Rating: 100mW; Supplier: Future Electronics; Supplier Part Number: 3697448; RoHS: Yes; Category: Chip SMD Resistors; Stock: 2355000; Pricing: 5000=0.0011, 20000=0.0011, 75000=0.001, 150000=0.001, 375000=0.001 (USD); Case/Package: 0603; Pins: 2; Case Code (Imperial): 0603; Case Code (Metric): 1608; Min Operating Temperature: -55°C; Max Operating Temperature: 155°C; Tolerance: 1%; Packaging: Tape and Reel; Resistor Type: Thick Film; Voltage Rating: 50V; Termination: SMD/SMT; Number of Terminations: 2; Features: Moisture Resistant; Series: RC; Max Power Dissipation: 100mW; Resistance Tolerance: 1%; Construction: Rectangular; Technology: THICK FILM; Length: 1.6mm; Width: 0.8mm; Height: 0.45mm; Depth: 0.8mm; Reach SVHC Compliant: No; Lead Free: 5697LeadFree; Military Standard: Not; RoHS Compliant: Yes; Manufacturer Part Number: RC0603FR-07100KL
R9 = RES; 22K; 0603; SMD; RC0603FR-0722KL: SMD Chip Resistor 22 Kohm ½ 1% 100 Mw 0603 [1608 Metric] Thick Film General Purpose; Manufacturer: Yageo; Temperature Coefficient: 100ppm/°C; Voltage Rating (DC): 50V; Power Rating: 100mW; Shielding: 202Shielding; Current Rating: 290mA; Supplier: Future Electronics; Supplier Part Number: 1933787; Manufacturer Part Number: RC0603FR-0722KL; RoHS: Yes; Category: Chip SMD Resistors; Stock: 5650000; Pricing: 5000=0.0012, 20000=0.0011, 75000=0.0011, 150000=0.0011, 375000=0.001 (USD); Case/Package: 0603; Pins: 2; Case Code (Imperial): 0603; Case Code (Metric): 1608; Min Operating Temperature: -55°C; Max Operating Temperature: 155°C; Tolerance: 1%; Packaging: Tape and Reel; Voltage Rating: 50V; Resistor Type: Thick Film; Number of Terminations: 2; Max Power Dissipation: 100mW; Features: Moisture Resistant; Termination: SMD/SMT; Series: RC; Resistance Tolerance: 1%; Package Quantity: 1; Construction: Rectangular; Diameter: 8.5mm; Length: 0.063inch; Width: 0.031inch; Height: 0.022inch; Depth: 0.8mm; Lead Pitch: 5mm; Radiation Hardening: 5898YesNo; Reach SVHC Compliant: No; Lead Free: 5697LeadFree; RoHS Compliant: Yes; Military Standard: Not
SP1 SP2 = SOLDERING PAD